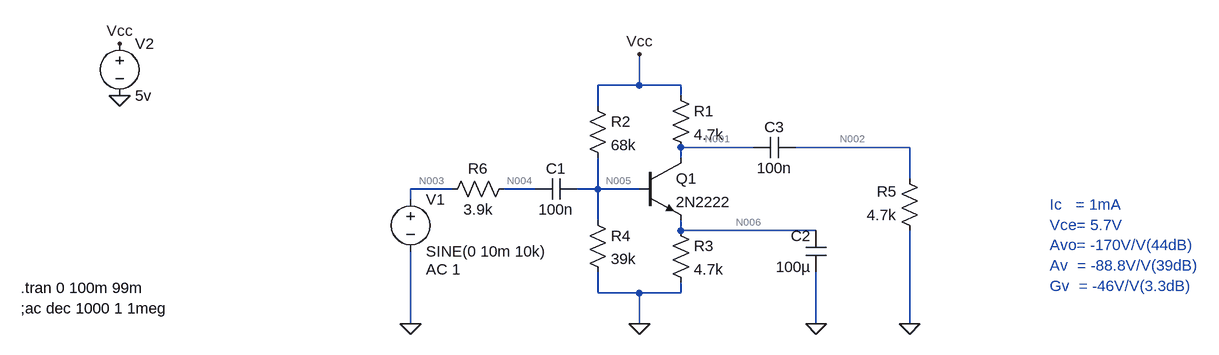
[diagram p0: schematic Example_1.asc]
Example_1.asc, the LTspice schematic file:
Version 4
SHEET 1 1336 680
WIRE 176 16 176 -32
WIRE 176 16 112 16
WIRE 240 16 176 16
WIRE 240 32 240 16
WIRE 112 48 112 16
WIRE 352 112 240 112
WIRE 592 112 416 112
WIRE 240 128 240 112
WIRE 592 160 592 112
WIRE -112 176 -176 176
WIRE 16 176 -32 176
WIRE 112 176 112 128
WIRE 112 176 80 176
WIRE 176 176 112 176
WIRE -176 192 -176 176
WIRE 112 224 112 176
WIRE 240 240 240 224
WIRE 448 240 240 240
WIRE 112 336 112 304
WIRE 176 336 112 336
WIRE 240 336 240 320
WIRE 240 336 176 336
WIRE -176 384 -176 272
WIRE 176 384 176 336
WIRE 448 384 448 304
WIRE 592 384 592 240
FLAG 176 384 0
FLAG 448 384 0
FLAG 592 384 0
FLAG -176 384 0
FLAG -624 32 0
FLAG -624 -48 Vcc
FLAG 176 -32 Vcc
SYMBOL npn 176 128 R0
SYMATTR InstName Q1
SYMATTR Value 2N2222
SYMBOL res 96 32 R0
SYMATTR InstName R2
SYMATTR Value 68k
SYMBOL res 224 224 R0
SYMATTR InstName R3
SYMATTR Value 4.7k
SYMBOL res 96 208 R0
SYMATTR InstName R4
SYMATTR Value 39k
SYMBOL cap 80 160 R90
WINDOW 0 0 32 VBottom 2
WINDOW 3 32 32 VTop 2
SYMATTR InstName C1
SYMATTR Value 100n
SYMBOL cap 464 304 R180
WINDOW 0 24 56 Left 2
WINDOW 3 24 8 Left 2
SYMATTR InstName C2
SYMATTR Value 100µ
SYMBOL cap 352 128 R270
WINDOW 0 32 32 VTop 2
WINDOW 3 0 32 VBottom 2
SYMATTR InstName C3
SYMATTR Value 100n
SYMBOL res 608 256 R180
WINDOW 0 36 76 Left 2
WINDOW 3 36 40 Left 2
SYMATTR InstName R5
SYMATTR Value 4.7k
SYMBOL res -128 192 R270
WINDOW 0 32 56 VTop 2
WINDOW 3 0 56 VBottom 2
SYMATTR InstName R6
SYMATTR Value 3.9k
SYMBOL voltage -176 176 R0
WINDOW 123 24 124 Left 2
WINDOW 39 0 0 Left 0
SYMATTR Value2 AC 1
SYMATTR InstName V1
SYMATTR Value SINE(0 10m 10k)
SYMBOL res 224 16 R0
SYMATTR InstName R1
SYMATTR Value 4.7k
SYMBOL voltage -624 -64 R0
WINDOW 123 0 0 Left 0
WINDOW 39 0 0 Left 0
SYMATTR InstName V2
SYMATTR Value 5v
TEXT -776 328 Left 2 !.tran 0 100m 99m
TEXT -776 360 Left 2 !;ac dec 1000 1 1meg
TEXT 808 200 Left 2 ;Ic   = 1mA\nVce= 5.7V\nAvo= -170V/V(44dB)\nAv  = -88.8V/V(39dB)\nGv  = -46V/V(3.3dB)

The netlist it stands for:
* Example_1.asc
Q1 N001 N005 N006 0 2N2222
R2 Vcc N005 68k
R3 N006 0 4.7k
R4 N005 0 39k
C1 N005 N004 100n
C2 0 N006 100µ
C3 N001 N002 100n
R5 0 N002 4.7k
R6 N003 N004 3.9k
V1 N003 0 SINE(0 10m 10k) AC 1
R1 Vcc N001 4.7k
V2 Vcc 0 5v
.model NPN NPN
.model PNP PNP
.lib standard.bjt
.tran 0 100m 99m
;ac dec 1000 1 1meg
* Ic   = 1mA
* Vce= 5.7V
* Avo= -170V/V(44dB)
* Av  = -88.8V/V(39dB)
* Gv  = -46V/V(3.3dB)
.backanno
.end

* Results of the author's LTspice run, read from the files saved beside the schematic
* Operating Point, zero values left out:
*   V(n001) = 3.832 V
*   V(n005) = 1.792 V
*   V(n006) = 1.174 V
*   V(vcc) = 5 V
*   Ic(Q1) = 248.5 µA
*   Ib(Q1) = 1.219 µA
*   Ie(Q1) = -249.7 µA
*   I(R2) = 47.17 µA
*   I(R3) = 249.7 µA
*   I(R4) = 45.95 µA
*   I(R1) = 248.5 µA
*   I(V2) = -295.6 µA
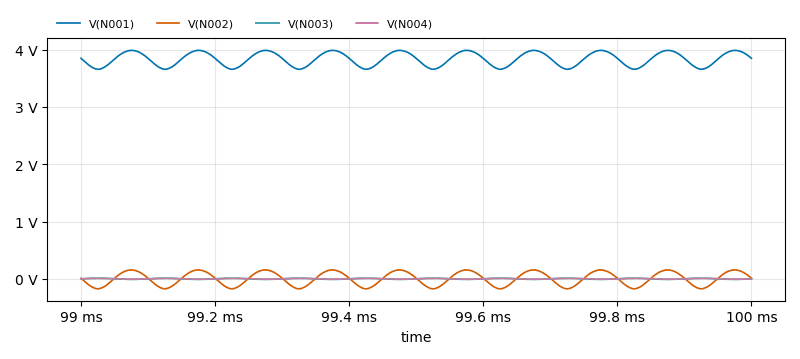
[diagram p1: Transient Analysis of Example_1.asc, plotted from the saved traces]
* Transient Analysis, 1 run:
*   V(N001): min 3.657 V, max 3.987 V, average 3.832 V, rms 3.834 V, last 3.848 V
*   V(N002): min -174.5 mV, max 155.1 mV, average 84.81 µV, rms 115.7 mV, last 10.34 mV
*   V(N003): min -9.999 mV, max 9.999 mV, average 48.7 nV, rms 7.081 mV, last 0 V
*   V(N004): min -7.515 mV, max 7.371 mV, average 1.165 µV, rms 5.233 mV, last -172.1 µV